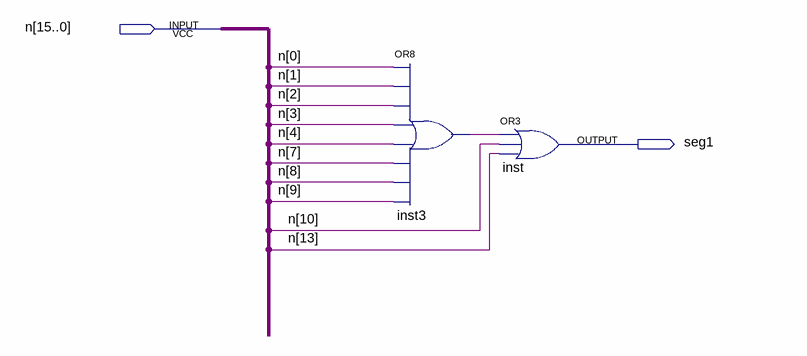
[diagram p0: schematic sheet]
// Quartus schematic seg1.bdf as structural Verilog: 2 symbols, 2 pins
module seg1 (
  input  [15:0] n,
  output seg1
);

  wire inst3_out;

  or inst3 (inst3_out, n[0], n[1], n[2], n[3], n[4], n[7], n[8], n[9]);
  or inst (seg1, inst3_out, n[10], n[13]);
endmodule
